# EAGLE design Distance sensors (EAGLE 9.0.1)
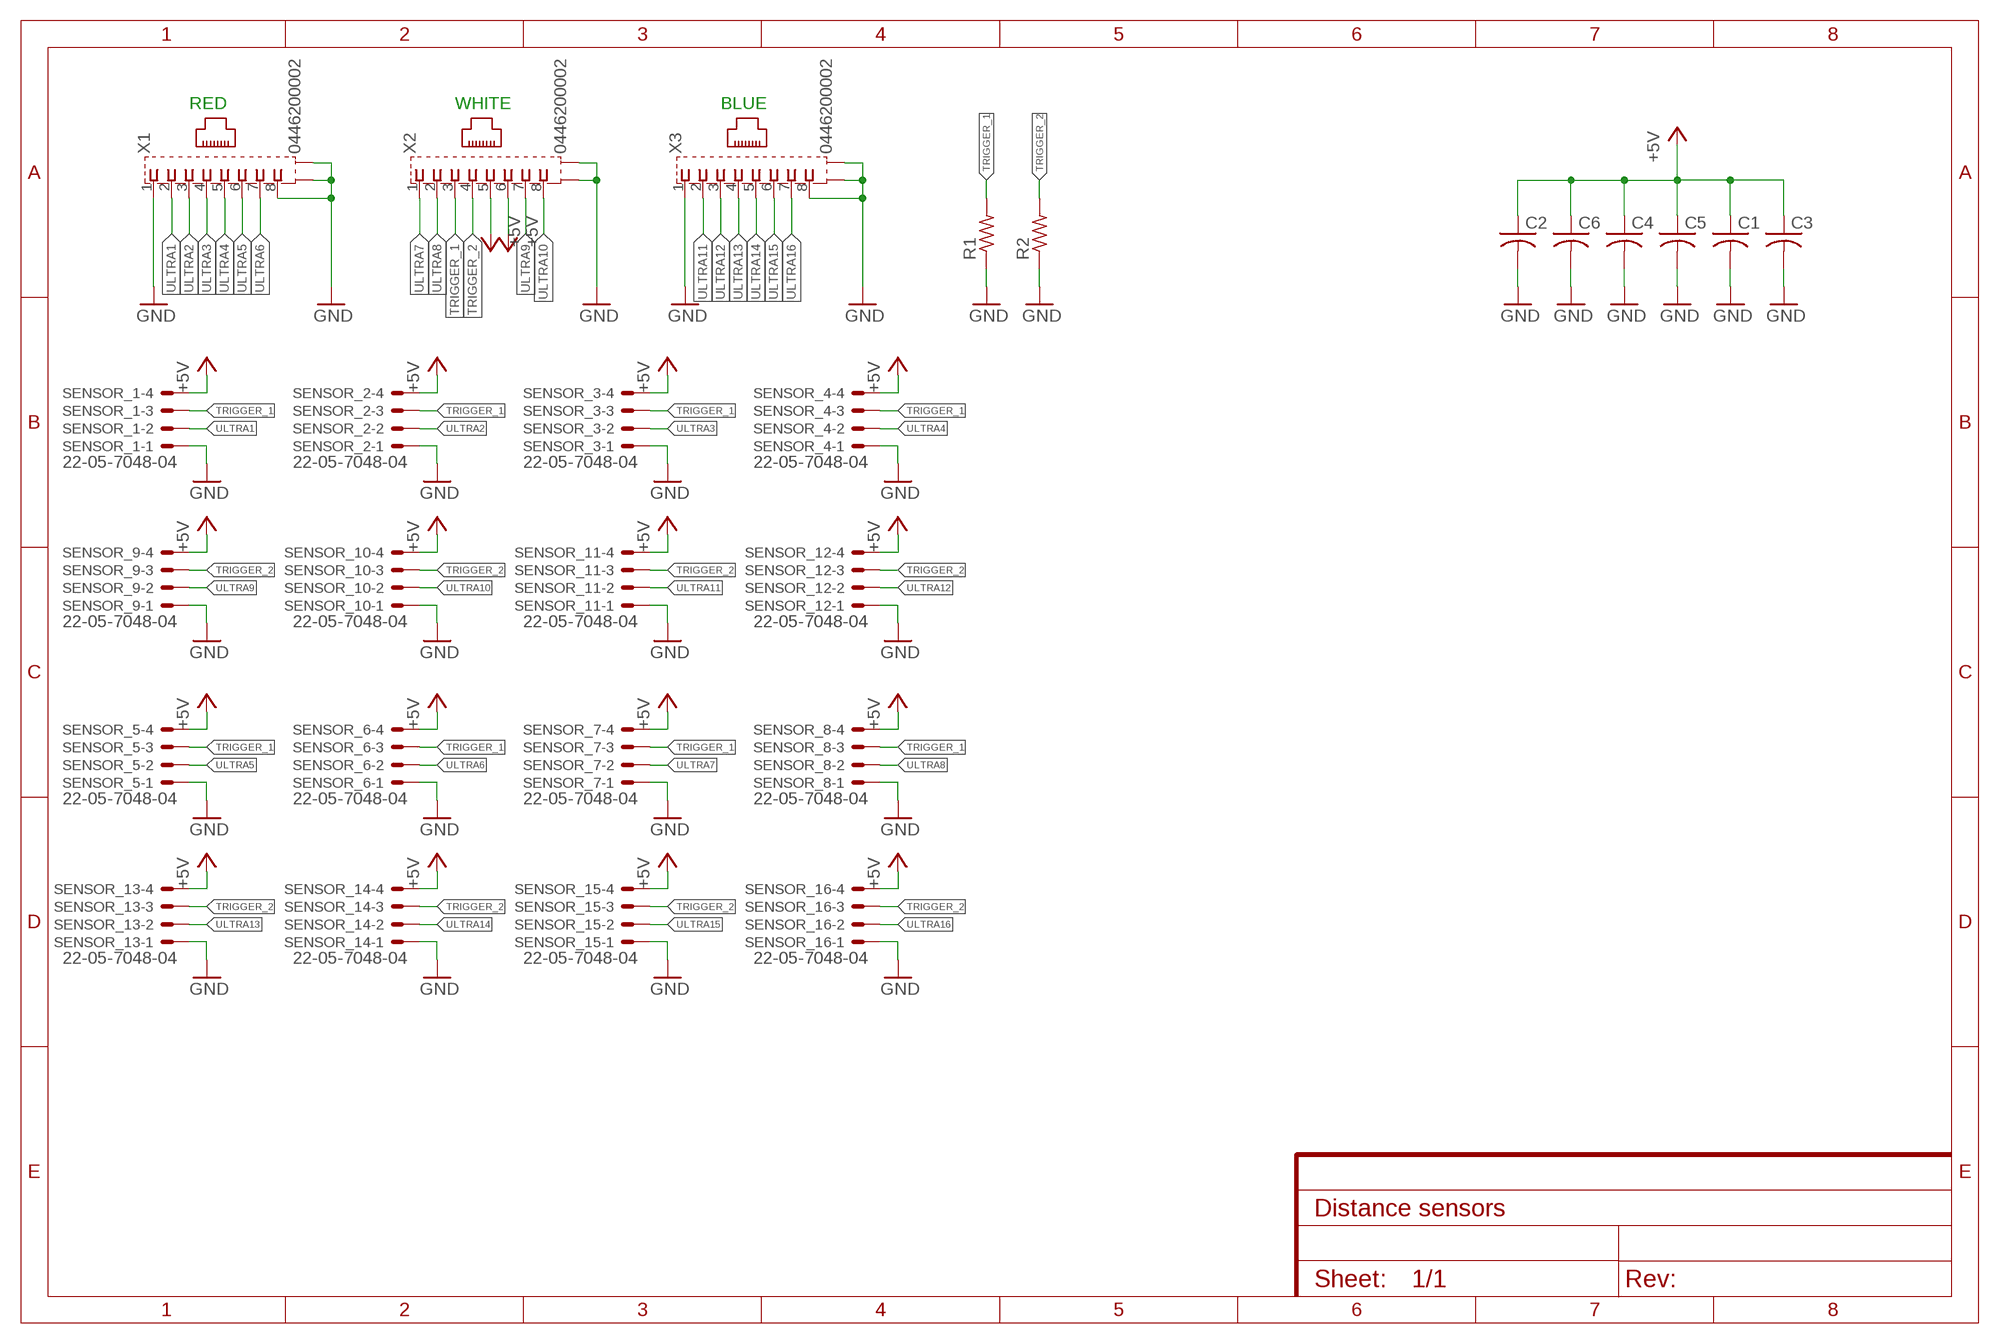
[diagram p0: schematic, sheet 1]

## Parts
C1  C-USC0805  [C0805]
C2  C-USC0805  [C0805]
C3  C-USC1206  [C1206]
C4  C-USC0805  [C0805]
C5  C-USC0805  [C0805]
C6  C-USC1206  [C1206]
R1  R-US_R1206  [R1206]
R2  R-US_R1206  [R1206]
SENSOR_1  22-05-7048-04  [7395-04]
SENSOR_2  22-05-7048-04  [7395-04]
SENSOR_3  22-05-7048-04  [7395-04]
SENSOR_4  22-05-7048-04  [7395-04]
SENSOR_5  22-05-7048-04  [7395-04]
SENSOR_6  22-05-7048-04  [7395-04]
SENSOR_7  22-05-7048-04  [7395-04]
SENSOR_8  22-05-7048-04  [7395-04]
SENSOR_9  22-05-7048-04  [7395-04]
SENSOR_10  22-05-7048-04  [7395-04]
SENSOR_11  22-05-7048-04  [7395-04]
SENSOR_12  22-05-7048-04  [7395-04]
SENSOR_13  22-05-7048-04  [7395-04]
SENSOR_14  22-05-7048-04  [7395-04]
SENSOR_15  22-05-7048-04  [7395-04]
SENSOR_16  22-05-7048-04  [7395-04]
X1  0446200002  [0446200002]
X2  0446200002  [0446200002]
X3  0446200002  [0446200002]

## Nets
+5V: C1.1 C2.1 C3.1 C4.1 C5.1 C6.1 SENSOR_1.4 SENSOR_2.4 SENSOR_3.4 SENSOR_4.4 SENSOR_5.4 SENSOR_6.4 SENSOR_7.4 SENSOR_8.4 SENSOR_9.4 SENSOR_10.4 SENSOR_11.4 SENSOR_12.4 SENSOR_13.4 SENSOR_14.4 SENSOR_15.4 SENSOR_16.4 X2.5 X2.6
GND: C1.2 C2.2 C3.2 C4.2 C5.2 C6.2 R1.1 R2.1 SENSOR_1.1 SENSOR_2.1 SENSOR_3.1 SENSOR_4.1 SENSOR_5.1 SENSOR_6.1 SENSOR_7.1 SENSOR_8.1 SENSOR_9.1 SENSOR_10.1 SENSOR_11.1 SENSOR_12.1 SENSOR_13.1 SENSOR_14.1 SENSOR_15.1 SENSOR_16.1 X1.1 X1.8 X1.S@1(S1) X1.S@2(S2) X2.S@1(S1) X2.S@2(S2) X3.1 X3.8 X3.S@1(S1) X3.S@2(S2)
TRIGGER_1: R1.2 SENSOR_1.3 SENSOR_2.3 SENSOR_3.3 SENSOR_4.3 SENSOR_5.3 SENSOR_6.3 SENSOR_7.3 SENSOR_8.3 X2.3
TRIGGER_2: R2.2 SENSOR_9.3 SENSOR_10.3 SENSOR_11.3 SENSOR_12.3 SENSOR_13.3 SENSOR_14.3 SENSOR_15.3 SENSOR_16.3 X2.4
ULTRA1: SENSOR_1.2 X1.2
ULTRA2: SENSOR_2.2 X1.3
ULTRA3: SENSOR_3.2 X1.4
ULTRA4: SENSOR_4.2 X1.5
ULTRA5: SENSOR_5.2 X1.6
ULTRA6: SENSOR_6.2 X1.7
ULTRA7: SENSOR_7.2 X2.1
ULTRA8: SENSOR_8.2 X2.2
ULTRA9: SENSOR_9.2 X2.7
ULTRA10: SENSOR_10.2 X2.8
ULTRA11: SENSOR_11.2 X3.2
ULTRA12: SENSOR_12.2 X3.3
ULTRA13: SENSOR_13.2 X3.4
ULTRA14: SENSOR_14.2 X3.5
ULTRA15: SENSOR_15.2 X3.6
ULTRA16: SENSOR_16.2 X3.7

## Notes on the sheet
- RED | WHITE | BLUE

## Library data of the parts
C1-C6 = adafruit:C-US: CAPACITOR, American symbol
R1 R2 = adafruit:R-US_: RESISTOR, American symbol
SENSOR_1-SENSOR_16 = con-molex:22-?-04: CONNECTOR wire to board 2.54 mm (.1 inch) pitch header; MF: MOLEX; OC_FARNELL: unknown; OC_NEWARK: unknown
X1-X3 = con-molex:0446200002: RJ-45 INVERTED MODULAR JACK ASSEMBLY WITH RJ-11 KEEPOUT FEATURE Source: Data sheet <http://www.farnell.com/datasheets/73207.pdf> MOLEX 0446200002 BUCHSE, RJ45, GESCHIRMT Source: Farnell <http://de.farnell.com/molex/0446200002/buchse-rj45-geschirmt/dp/9251910?ost=9251910>; MF: MOLEX; MPN: 0446200002; OC_FARNELL: 9251910

## Board
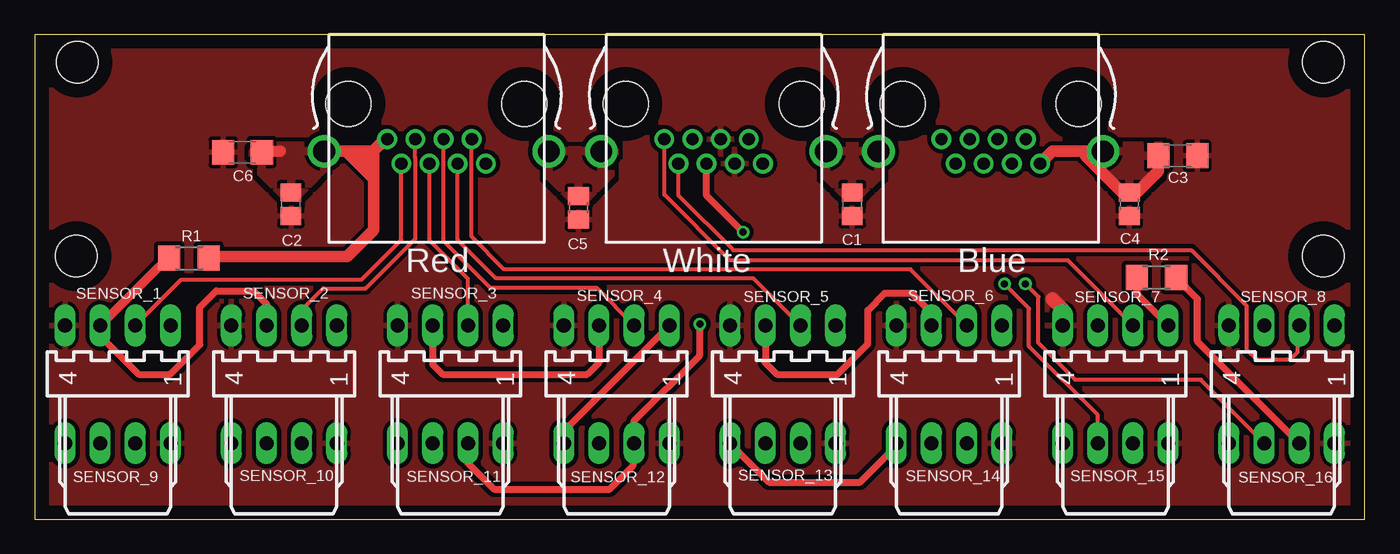
[diagram p1: board, top side]
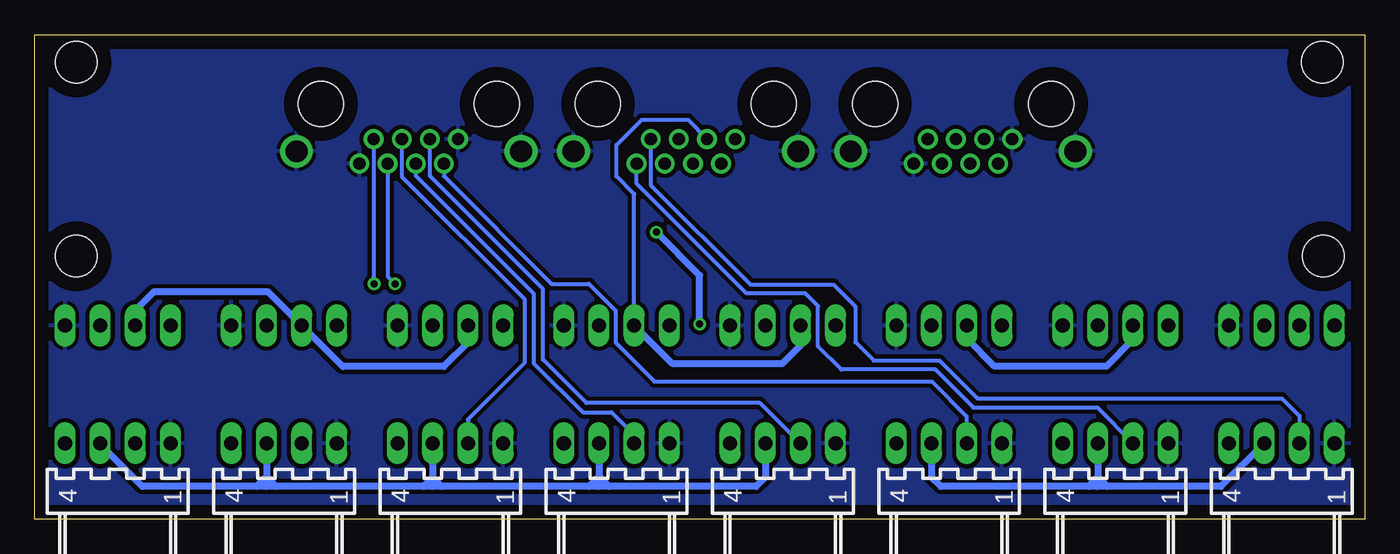
[diagram p2: board, bottom side, seen from below]

Size 96 x 35 mm. Coordinates in mm from the lower left corner, seen from the top.
Outline: 0,0 96,0 96,35 0,35 0,0
Copper layers (1*16): Top 0.035mm / dielectric 1.5mm / Bottom 0.035mm
Design rules "default": minimum track width 6mil, minimum drill 0.35mm, track to track 6mil, track to pad 6mil, pad to pad 6mil, via to via 6mil, smd to smd 6mil, copper to edge 40mil, drill to drill 6mil, minimum pad ring 10mil, minimum via ring 8mil, stop-mask expansion 4mil, vias tented up to drill 0mil, thermal gap 10mil
Holes 3 mm at 3.09,33 93,33 93,19 3,19

### Footprints (pad centres in the part's own frame; a part is rotated, then mirrored left to right if it is on the bottom)
C0805 = smd 1.3 x 1.5: 1 -0.85,0; 2 0.85,0
C1206 = smd 1.6 x 1.8: 1 -1.4,0; 2 1.4,0
R1206 = smd 1.6 x 1.803: 1 -1.422,0; 2 1.422,0
7395-04 = drill 1.016 long: 1 3.81,0; 2 1.27,0; 3 -1.27,0; 4 -3.81,0
0446200002 = drill 0.889 pad 1.422: 1 3.556,2.54; 2 2.54,4.318; 3 1.524,2.54; 4 0.508,4.318; 5 -0.508,2.54; 6 -1.524,4.318; 7 -2.54,2.54; 8 -3.556,4.318 | drill 1.575 pad 2.286: S@1 -8.103,3.429; S@2 8.103,3.429 | hole 3.251: 6.35,0; -6.35,0

### Placement (x,y rotation side)
C1  59,22.75 90 top
C2  18.5,22.75 90 top
C3  82.5,26.25 180 top
C4  79,22.75 90 top
C5  39.25,22.5 90 top
C6  15,26.5 0 top
R1  11.14,18.85 180 top
R2  80.96,17.46 0 top
SENSOR_1  6,14 0 top
SENSOR_2  18,14 0 top
SENSOR_3  30,14 0 top
SENSOR_4  42,14 0 top
SENSOR_5  54,14 0 top
SENSOR_6  66,14 0 top
SENSOR_7  78,14 0 top
SENSOR_8  90,14 0 top
SENSOR_9  6,5.5 0 bottom
SENSOR_10  18,5.5 0 bottom
SENSOR_11  30,5.5 0 bottom
SENSOR_12  42,5.5 0 bottom
SENSOR_13  54,5.5 0 bottom
SENSOR_14  66,5.5 0 bottom
SENSOR_15  78,5.5 0 bottom
SENSOR_16  90,5.5 0 bottom
X1  29,30 180 top
X2  49,30 180 top
X3  69,30 180 top

### Tracks (layer width: path | path; a pad name or v marks a point on that pad's centre or on a via)
+5V
  Top 1.016: 86.15,14.04 SENSOR_8.4 | SENSOR_7.4 74.19,15.17 73.46,15.9
  pour Top (isolate 0.305, rank 2): 0.04,35.01 96.07,35.01 96.07,0 0.03,0 0.03,35.02 0.04,35.02
GND
  Top 0.508: SENSOR_4.1 38.19,6.38 SENSOR_12.1 | SENSOR_14.1 62.19,5.31 59.56,2.69 53,2.69 SENSOR_13.1 | R2.1 79.53,16.28 SENSOR_7.1
  Top 0.813: 24.46,24.61 24.46,20.89 22.54,18.97 12.68,18.97 R1.1 | 24.46,24.61 24.46,25.36 | 24.46,25.36 24.46,26.61 | 24.46,26.61 25.31,27.46 X1.1 | 24.46,26.61 24.42,26.57 23.25,26.57 | 23.25,26.57 22.49,26.57 | 23.25,26.57 24.46,25.36 | 17.72,26.57 C6.2 | 24.46,24.61 22.49,26.57 | 22.49,26.57 X1.S@2 | X3.S@1 75.83,26.57 | 75.83,26.57 73.44,26.57 X3.8 | 75.83,26.57 75.83,26.26 78.49,23.6 C4.2 79.56,23.6 81.1,25.14 C3.2
  pour Bottom (isolate 0.305, rank 2): 0.06,35.02 96.06,35.02 96.06,0.06 0.05,0.06 0.05,35.03
  pour Top (isolate 0.305): 56.29,26.52 56.29,25.63 58.59,23.32 59.45,23.32 60.06,23.94 61.6,25.48 61.6,26.95 56.7,26.95 56.28,26.53
  pour Top (isolate 0.305): 36.54,26.24 36.54,25.35 38.84,23.05 39.7,23.05 40.32,23.67 41.85,25.2 41.85,26.68 36.95,26.68 36.53,26.26
  pour Top (isolate 0.305): 76.32,26.56 76.32,25.67 78.62,23.37 79.47,23.37 80.09,23.99 81.63,25.52 81.63,27 76.73,27 76.31,26.58
  pour Top (isolate 0.305): 15.74,26.54 15.74,25.65 18.04,23.35 18.9,23.35 19.52,23.97 21.05,25.5 21.05,26.98 16.15,26.98 15.73,26.56
TRIGGER_1
  Top 0.508: SENSOR_1.3 4.73,13.26 7.52,10.47 9.79,10.47 11.92,12.6 11.92,15.3 13.11,16.49 15.81,16.49 16.74,15.56 SENSOR_2.3 | SENSOR_3.3 28.73,11.19 29.45,10.47 39.89,10.47 40.73,11.31 SENSOR_4.3 | SENSOR_5.3 52.73,11.31 53.57,10.47 57.94,10.47 60.13,12.65 60.13,15.1 61.36,16.33 63.29,16.33 64.73,14.89 SENSOR_6.3 64.72,13.99
  Top 0.61: SENSOR_1.3 9,18.27 R1.2
  Bottom 0.305: SENSOR_5.3 52.73,23.5 54.01,24.78 54.01,27.02 52.18,28.85 48.86,28.85 X2.3
  Bottom 0.508: SENSOR_2.3 16.73,12.97 18.65,11.06 26.72,11.06 28.73,13.06 SENSOR_3.3 | SENSOR_4.3 40.73,12.57 42.06,11.24 49.97,11.24 SENSOR_5.3 | SENSOR_6.3 64.73,12.78 66.47,11.04 73.77,11.04 76.87,14.14 | SENSOR_7.3 79.15,16.42 87.4,16.42 88.73,15.09 SENSOR_8.3
  Bottom 0.61: SENSOR_7.3 76.87,14.14
TRIGGER_2  (via drill 0.5)
  Top 0.508: v48,14.1 v48,14.09 48,11.85 43.27,7.11 SENSOR_12.3 43.21,5.44 43.21,3.9 41.5,2.19 33.15,2.19 31.27,4.06 SENSOR_11.3 | v51.12,20.73 48.49,23.36 X2.4 | SENSOR_16.3 83.93,12.84 83.93,15.91 R2.2
  Bottom 0.508: SENSOR_9.3 10.39,2.38 18.59,2.38 | 18.59,2.38 19.34,2.38 | 19.34,2.38 19.95,2.38 | 19.95,2.38 30.6,2.38 31.27,3.04 SENSOR_11.3 | 54.56,2.38 43.93,2.38 43.27,3.04 SENSOR_12.3 | 54.56,2.38 55.31,2.38 | 55.31,2.38 55.98,2.38 | 55.98,2.38 66.61,2.38 | 66.61,2.38 67.29,2.38 | 67.29,2.38 67.92,2.38 | 67.92,2.38 78.56,2.38 | 78.56,2.38 79.27,2.38 | 79.27,2.38 79.99,2.38 | 79.99,2.38 88.22,2.38 91.27,5.43 SENSOR_16.3 | SENSOR_10.3 19.27,3.06 | 19.27,3.06 19.27,2.45 19.34,2.38 | 19.27,3.06 18.59,2.38 | 19.27,3.06 19.95,2.38 | SENSOR_13.3 55.27,3.09 | 55.27,3.09 55.27,2.42 55.31,2.38 | 55.27,3.09 54.56,2.38 | 55.27,3.09 55.98,2.38 | SENSOR_14.3 67.27,3.03 | 67.27,3.03 67.27,2.4 67.29,2.38 | 67.27,3.03 66.61,2.38 | 67.27,3.03 67.92,2.38 | SENSOR_15.3 79.27,3.1 | 79.27,3.09 79.27,2.38 | 79.27,3.1 79.27,3.09 | 79.27,3.09 78.56,2.38 | 79.27,3.1 79.99,2.38 | v48,14.1 48,17.61 v51.12,20.73
ULTRA1
  Top 0.305: 7.27,12.93 SENSOR_1.2 10.59,17.32 23.6,17.32 26.46,20.18 X1.2
ULTRA2
  Top 0.305: X1.3 27.47,26.11 27.48,26.1 27.48,20.27 23.88,16.67 20.83,16.67 19.27,15.11 SENSOR_2.2
ULTRA3
  Top 0.305: SENSOR_3.2 31.27,17.37 28.49,20.15 X1.4
ULTRA4
  Top 0.305: SENSOR_4.2 40.58,16.69 32.91,16.69 29.51,20.09 X1.5
ULTRA5
  Top 0.305: SENSOR_5.2 51.86,17.41 33.3,17.41 30.52,20.18 X1.6
ULTRA6
  Top 0.305: SENSOR_6.2 63.22,18.05 33.89,18.05 31.54,20.4 X1.7
ULTRA7
  Top 0.305: X2.1 45.44,23.45 50.16,18.72 74.55,18.72 SENSOR_7.2
ULTRA8
  Top 0.305: X2.2 46.46,23.39 50.42,19.44 83.46,19.44 87.46,15.44 87.46,12.28 88.19,11.55 90.64,11.55 91.16,12.08 91.16,13.89 SENSOR_8.2 | X2.2
ULTRA9
  Bottom 0.305: X2.7 51.54,24.15 44.34,16.95 38.36,16.95 36.78,15.37 36.78,12.8 35.44,11.47 30.69,11.47 27.95,8.73 5.98,8.73 4.73,7.47 SENSOR_9.2
ULTRA10
  Bottom 0.305: SENSOR_10.2 19.3,8.07 28.25,8.07 31,10.81 37.78,10.81 39.47,12.5 39.47,15.4 40.38,16.31 44.64,16.31 52.56,24.23 X2.8
ULTRA11
  Bottom 0.305: X3.2 66.46,24.78 58.68,17 56,17 54.07,15.07 54.07,12.76 51.27,9.96 31.26,9.96 28.74,7.44 SENSOR_11.2
ULTRA12
  Bottom 0.305: SENSOR_12.2 43.64,8.41 56.18,8.41 59.32,11.54 59.32,16.64 67.48,24.8 X3.3
ULTRA13
  Bottom 0.305: X3.4 68.49,24.8 59.98,16.29 59.98,11.27 56.44,7.73 54.38,7.73 52.73,6.08 SENSOR_13.2
ULTRA14
  Bottom 0.305: X3.5 69.51,24.76 60.65,15.9 60.65,11.29 64.73,7.21 SENSOR_14.2
ULTRA15  (via drill 0.5)
  Top 0.305: SENSOR_15.2 76.73,7.53 71.76,12.49 71.76,15.22 70,16.98 v70,17
  Bottom 0.305: X3.6 70.52,17.52 v70,17
ULTRA16  (via drill 0.5)
  Top 0.305: SENSOR_16.2 84.16,10.07 75.1,10.07 72.44,12.73 72.44,16.06 v71.5,17
  Bottom 0.305: v71.5,17 71.54,17.46 X3.7

### Text on the board
tPlace: Red | White | Blue